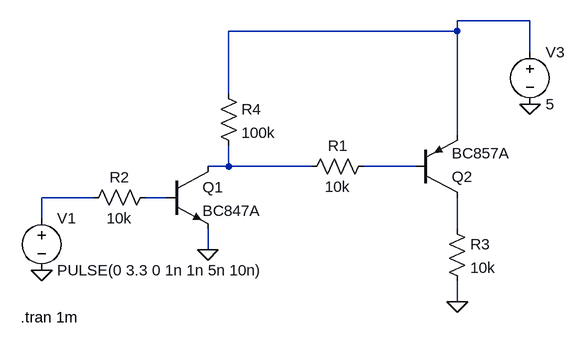
[diagram p0: schematic Backlight_simu.asc]
Backlight_simu.asc, the LTspice schematic file:
Version 4
SHEET 1 880 680
WIRE 656 -80 544 -80
WIRE 544 -64 544 -80
WIRE 544 -64 192 -64
WIRE 656 -32 656 -80
WIRE 192 32 192 -64
WIRE 544 96 544 -64
WIRE 192 144 192 112
WIRE 192 144 160 144
WIRE 320 144 192 144
WIRE 480 144 400 144
WIRE -16 192 -96 192
WIRE 96 192 64 192
WIRE -96 224 -96 192
WIRE 544 240 544 192
WIRE 160 272 160 240
WIRE 544 352 544 320
FLAG -96 304 0
FLAG 160 272 0
FLAG 544 352 0
FLAG 656 48 0
SYMBOL npn 96 144 R0
SYMATTR InstName Q1
SYMATTR Value BC847A
SYMBOL res 416 128 R90
WINDOW 0 0 56 VBottom 2
WINDOW 3 32 56 VTop 2
SYMATTR InstName R1
SYMATTR Value 10k
SYMBOL res 80 176 R90
WINDOW 0 0 56 VBottom 2
WINDOW 3 32 56 VTop 2
SYMATTR InstName R2
SYMATTR Value 10k
SYMBOL voltage -96 208 R0
WINDOW 123 0 0 Left 0
WINDOW 39 0 0 Left 0
SYMATTR InstName V1
SYMATTR Value PULSE(0 3.3 0 1n 1n 5n 10n)
SYMBOL voltage 656 -48 R0
WINDOW 123 0 0 Left 0
WINDOW 39 0 0 Left 0
SYMATTR InstName V3
SYMATTR Value 5
SYMBOL res 528 224 R0
SYMATTR InstName R3
SYMATTR Value 10k
SYMBOL pnp 480 192 M180
SYMATTR InstName Q2
SYMATTR Value BC857A
SYMBOL res 176 16 R0
SYMATTR InstName R4
SYMATTR Value 100k
TEXT -128 376 Left 2 !.tran 1m

The netlist it stands for:
* Backlight_simu.asc
Q1 N002 N005 0 0 BC847A
R1 N003 N002 10k
R2 N005 N004 10k
V1 N004 0 PULSE(0 3.3 0 1n 1n 5n 10n)
V3 N001 0 5
R3 N006 0 10k
Q2 N006 N003 N001 0 BC857A
R4 N001 N002 100k
.model NPN NPN
.model PNP PNP
.lib standard.bjt
.tran 1m
.backanno
.end